# Altium schematic sheet TSAL.SchDoc
size A
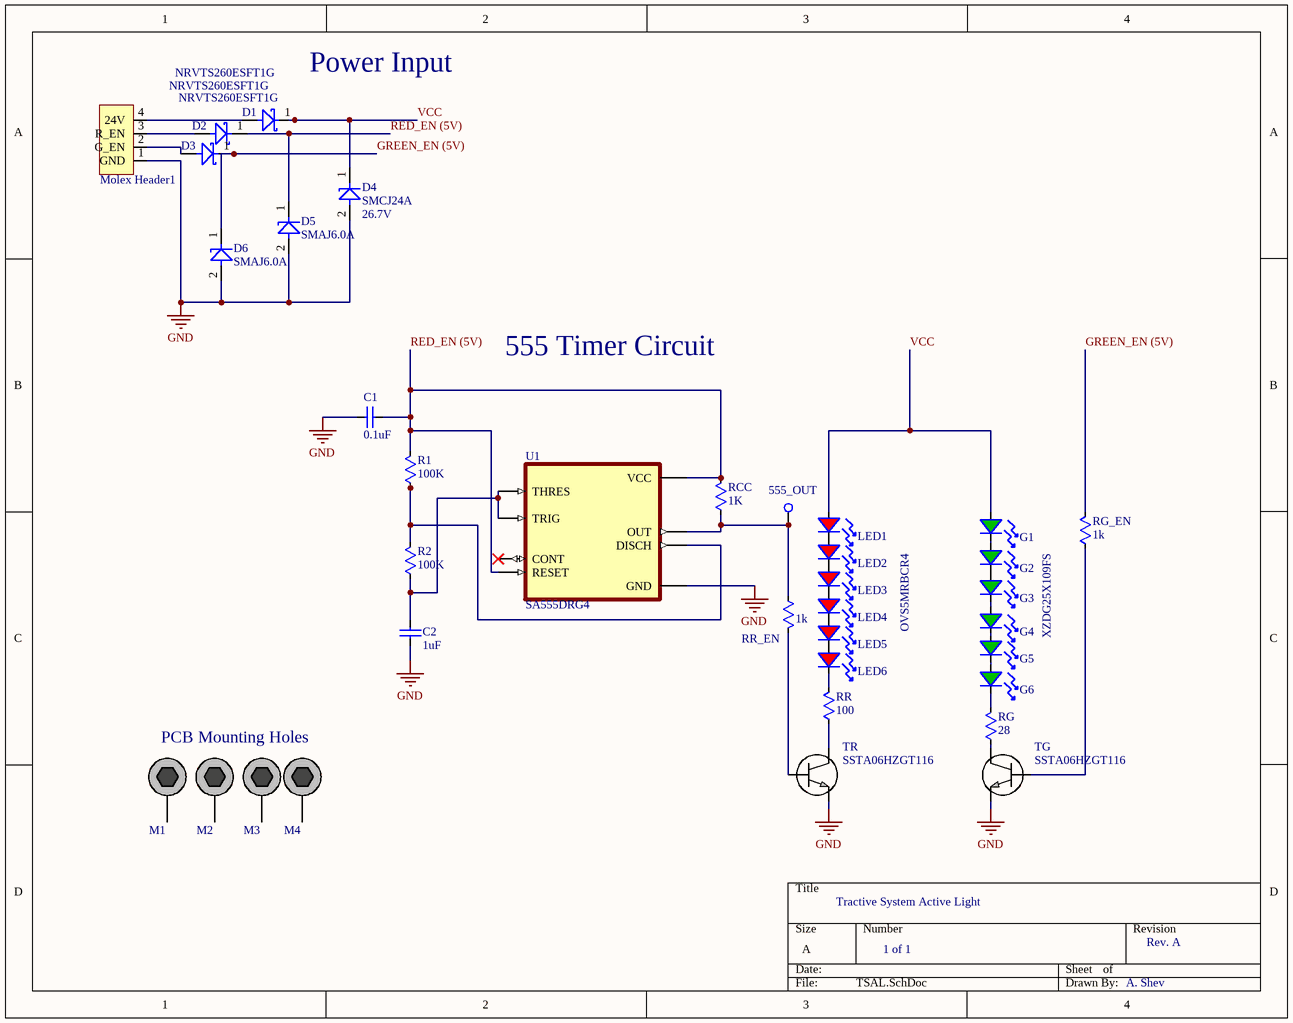
[diagram p0: TSAL.SchDoc]

## Parts
555_OUT  Thru-Hole Test Point  [TESTPOINT (THROUGH-HOLE)]  (value not drawn)
C1  value 0.1uF  [0603 CAPACITOR (TDK C-SERIES)]  (hidden comment: 0603)
C2  value 1uF  [0603 CAPACITOR (TDK C-SERIES)]  (hidden comment: 0603 CL10A105KA8NNNC)
D1  NRVTS260ESFT1G  [ON NRVTS260ESFT1G]
D2  NRVTS260ESFT1G  [ON NRVTS260ESFT1G]
D3  NRVTS260ESFT1G  [ON NRVTS260ESFT1G]
D4  SMCJ24A  value 26.7V  [LITTELFUSE SMCJ24A]
D5  SMAJ6.0A  [LITTELFUSE SMAJ6.0A]
D6  SMAJ6.0A  [LITTELFUSE SMAJ6.0A]
G1  XZDG25X109FS  [GREEN LED]
G2  XZDG25X109FS  [GREEN LED]  (value not drawn)
G3  XZDG25X109FS  [GREEN LED]  (value not drawn)
G4  XZDG25X109FS  [GREEN LED]  (value not drawn)
G5  XZDG25X109FS  [GREEN LED]  (value not drawn)
G6  XZDG25X109FS  [GREEN LED]  (value not drawn)
LED1  OVS5MRBCR4  [RED LED]
LED2  OVS5MRBCR4  [RED LED]  (value not drawn)
LED3  OVS5MRBCR4  [RED LED]  (value not drawn)
LED4  OVS5MRBCR4  [RED LED]  (value not drawn)
LED5  OVS5MRBCR4  [RED LED]  (value not drawn)
LED6  OVS5MRBCR4  [RED LED]  (value not drawn)
M1  M1  [M3 SCREW HOLE (Non-Plated)]
M2  M2  [M3 SCREW HOLE (Non-Plated)]
M3  M3  [M3 SCREW HOLE (Non-Plated)]
M4  M4  [M3 SCREW HOLE (Non-Plated)]
Molex_Header1  MolexHeader  [4-Pin Bare Wire Pads]  (value not drawn)
R1  value 100K  [0603 RESISTOR (YAGEO)]  (hidden comment: 0603)
R2  value 100K  [0603 RESISTOR (YAGEO)]  (hidden comment: 0603)
RCC  value 1K  [0603 RESISTOR (YAGEO)]  (hidden comment: 0603)
RG  value 28  [0603 RESISTOR (YAGEO)]  (hidden comment: 0603)
RG_EN  value 1k  [0603 RESISTOR (YAGEO)]  (hidden comment: 0603)
RR  value 100  [0603 RESISTOR (YAGEO)]  (hidden comment: 0603)
RR_EN  value 1k  [0603 RESISTOR (YAGEO)]  (hidden comment: 0603)
TG  SSTA06HZGT116  [TRANSISTOR]
TR  SSTA06HZGT116  [TRANSISTOR]
U1  SA555DRG4  [555TIMER]

## Nets
GND: C1.2 C2.2 D4.2(Anode) D5.2 D6.2 Molex_Header1.1(GND) TG.1(Emitter) TR.1(Emitter) U1.1GND(GND)
GREEN_EN (5V): D3.1(Cathode) D6.1 RG_EN.2
RED_EN (5V): C1.1 D2.1(Cathode) D5.1 R1.2 RCC.2 U1.4RESET(RESET) U1.8VCC(VCC)
VCC: D1.1(Cathode) D4.1(Cathode) G1.1 LED1.1
Net555_OUT_1: 555_OUT.1(TP) RCC.1 RR_EN.1 U1.3OUT(OUT)
NetC2_1: C2.1 R2.1 U1.2TRIG(TRIG) U1.6THRESH(THRES)
NetD1_2: D1.2 Molex_Header1.4(24V)
NetD2_2: D2.2 Molex_Header1.3(R_EN)
NetD3_2: D3.2 Molex_Header1.2(G_EN)
NetG1_2: G1.2 G2.1
NetG2_2: G2.2 G3.1
NetG3_2: G3.2 G4.1
NetG4_2: G4.2 G5.1
NetG5_2: G5.2 G6.1
NetG6_2: G6.2 RG.2
NetLED1_2: LED1.2(s) LED2.1
NetLED2_2: LED2.2(s) LED3.1
NetLED3_2: LED3.2(s) LED4.1
NetLED4_2: LED4.2(s) LED5.1
NetLED5_2: LED5.2(s) LED6.1
NetLED6_2: LED6.2(s) RR.2
NetR1_1: R1.1 R2.2 U1.7DISCH(DISCH)
NetRG_1: RG.1 TG.3(Collector)
NetRG_EN_1: RG_EN.1 TG.2(Base)
NetRR_1: RR.1 TR.3(Collector)
NetRR_EN_2: RR_EN.2 TR.2(Base)

Not connected (* = marked no-connect by the designer): M1 1; M2 1; M3 1; M4 1; U1 5CONT(CONT)*

## Notes on the sheet
- (near D1) Power Input
- 555 Timer Circuit
- PCB Mounting Holes
- Tractive System Active Light
- 1 of 1
- Rev. A
- A. Shev

## Library data of the parts
C1 = 0603 Ceramic Capacitor: Supplier 1: Digi-Key; Supplier Part Number 1: 399-17393-1-ND
C2 = 0603 Ceramic Capacitor: CAP CER 1UF 25V X5R 0603; Supplier 1: Digi-Key; Supplier Part Number 1: 1276-1102-1-ND
D1-D3 = ON NRVTS260ESFT1G: Diode Schottky 60V 2A Surface Mount SOD-123FL; Supplier 1: Digi-Key; Supplier Part Number 1: NRVTS260ESFT1GOSCT-ND
D4 = Littelfuse SMCJ24A: 38.9V Clamp 38.6A Ipp Tvs Diode Surface Mount DO-214AB (SMCJ); Supplier Part Number 1: SMCJ24ALFCT-ND; Supplier 1: Digikey
D5 D6 = LF SMAJ6.0A: 10.3V Clamp 38.8A Ipp Tvs Diode Surface Mount DO-214AC (SMA); Supplier 1: Digi-Key; Supplier Part Number 1: SMAJ6.0ALFCT-ND
G1-G6 = GREEN LED: Green 525nm LED Indication - Discrete 3.5V 1411 (3528 Metric); Supplier 1: Digikey; Supplier Part Number 1: 1497-1345-1-ND
LED1-LED6 = RED LED: Red 625nm LED Indication - Discrete 2.2V 2-SMD, No Lead; Supplier 1: Digikey; Supplier Part Number 1: 365-1546-1-ND
M1-M4 = M3 Non-Plated Mounting Holes
R1 R2 RG_EN RR_EN = 0603 Resistor: Supplier 1: Digi-Key
  R1 R2: Supplier Part Number 1: YAG1235CT-ND
  RG_EN RR_EN: Supplier Part Number 1: 541-1.00KSCT-ND
RCC = 0603 Resistor: RES SMD 1 OHM 1% 1/3W 0603; Supplier 1: Digi-Key; Supplier Part Number 1: 541-1.00KSCT-ND
RG = 0603 Resistor: RES SMD 28 OHM 1% 1/3W 0603; Supplier 1: Digi-Key; Supplier Part Number 1: 541-28.0SCT-ND
RR = 0603 Resistor: RES SMD 100 OHM 2% 1.5W 0603; Supplier 1: Digi-Key; Supplier Part Number 1: 541-2653-1-ND
TG TR = SSTA06HZGT116: Bipolar (BJT) Transistor NPN 100MHz Surface Mount SST3; Vendor: ROHM Semiconductor; Built_By: EMA_Matt; SourceLibrary: Rohm_2019-09-23; Manufacturer_Part_Number: SSTA06HZGT116; Copyright: Copyright (C) 2018 Accelerated Designs. All rights reserved; RefDes: RefDes; Type: DEV
U1 = SA555DRG4: Precision timer for -55 to 85C operation 8-SOIC -40 to 85; MF: Texas Instruments; Check_prices: https://www.snapeda.com/parts/SA555DRG4/Texas%20Instruments/view-part/387582/?ref=eda; Package: SOIC-8 Texas Instruments; Purchase-URL: https://pricing.snapeda.com/search/part/SA555DRG4/?ref=eda; MP: SA555DRG4; Value: *; SnapEDA_Link: https://www.snapeda.com/parts/SA555DRG4/Texas%20Instruments/view-part/387582/?ref=snap; Supplier Part Number: 296-48948-1-ND; Supplier: Digi-Key